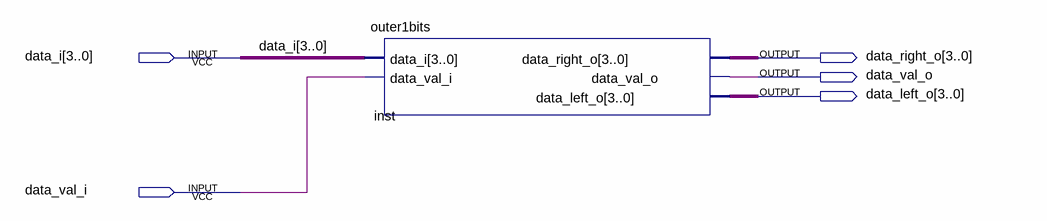
[diagram p0: schematic sheet]
// Quartus schematic top.bdf as structural Verilog: 1 symbols, 5 pins
module top (
  input  [3:0] data_i,
  input  data_val_i,
  output [3:0] data_right_o,
  output data_val_o,
  output [3:0] data_left_o
);

  outer1bits inst (
    .data_i(data_i), .data_val_i(data_val_i), .data_right_o(data_right_o), .data_val_o(data_val_o),
    .data_left_o(data_left_o));
endmodule
